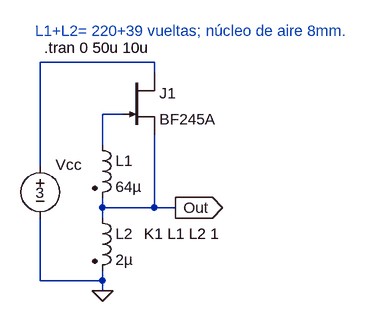
[diagram p0: schematic HartleyNjfetMinimal.asc]
HartleyNjfetMinimal.asc, the LTspice schematic file:
Version 4
SHEET 1 880 680
WIRE -176 272 -176 112
WIRE -176 448 -176 352
WIRE -80 240 -80 192
WIRE -80 336 -80 320
WIRE -80 352 -80 336
WIRE -80 448 -176 448
WIRE -80 448 -80 432
WIRE -80 464 -80 448
WIRE -48 192 -80 192
WIRE 0 112 -176 112
WIRE 0 128 0 112
WIRE 0 336 -80 336
WIRE 0 336 0 224
WIRE 32 336 0 336
FLAG -80 464 0
FLAG 32 336 Out
IOPIN 32 336 Out
SYMBOL njf -48 128 R0
SYMATTR InstName J1
SYMATTR Value BF245A
SYMBOL ind2 -96 224 R0
SYMATTR InstName L1
SYMATTR Value 64µ
SYMATTR SpiceLine Cpar=10p
SYMBOL ind2 -96 336 R0
SYMATTR InstName L2
SYMATTR Value 2µ
SYMATTR SpiceLine Cpar=4p
SYMBOL voltage -176 256 R0
WINDOW 0 24 14 Left 0
WINDOW 3 -7 57 Left 0
WINDOW 123 0 0 Left 0
WINDOW 39 0 0 Left 0
SYMATTR InstName Vcc
SYMATTR Value 3
TEXT -16 376 Left 0 !K1 L1 L2 1
TEXT -170 90 Left 0 !.tran 0 50u 10u
TEXT -184 64 Left 0 ;L1+L2= 220+39 vueltas; núcleo de aire 8mm.

The netlist it stands for:
* HartleyNjfetMinimal.asc
J1 N001 N002 Out BF245A
L1 N002 Out 64µ Cpar=10p
L2 Out 0 2µ Cpar=4p
Vcc N001 0 3
.model NJF NJF
.model PJF PJF
.lib standard.jft
K1 L1 L2 1
.tran 0 50u 10u
* L1+L2= 220+39 vueltas; núcleo de aire 8mm.
.backanno
.end